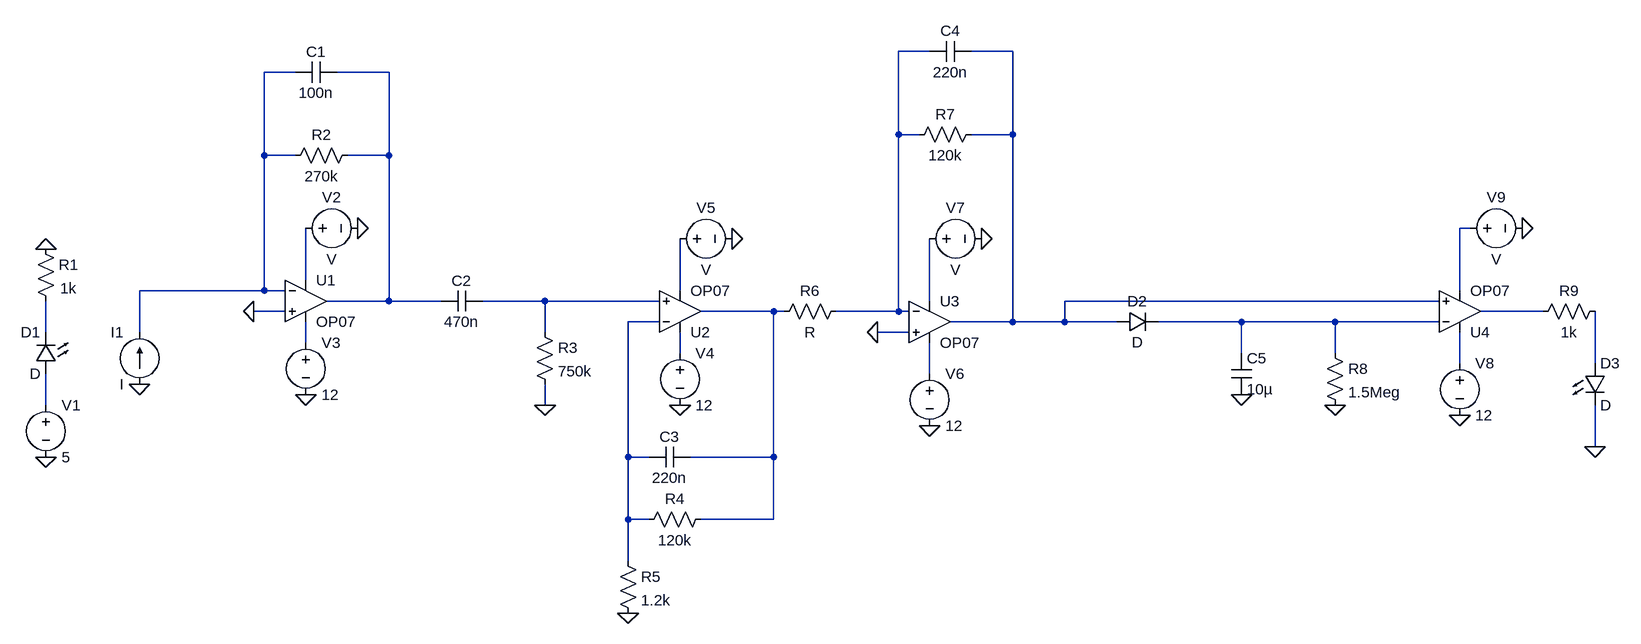
[diagram p0: schematic Pulsefit.asc]
Pulsefit.asc, the LTspice schematic file:
Version 4
SHEET 1 2460 680
WIRE 1376 -432 1328 -432
WIRE 1504 -432 1440 -432
WIRE 400 -400 352 -400
WIRE 544 -400 464 -400
WIRE 1328 -304 1328 -432
WIRE 1360 -304 1328 -304
WIRE 1504 -304 1504 -432
WIRE 1504 -304 1440 -304
WIRE 352 -272 352 -400
WIRE 400 -272 352 -272
WIRE 544 -272 544 -400
WIRE 544 -272 480 -272
WIRE 2208 -160 2192 -160
WIRE 416 -80 416 -160
WIRE 352 -64 352 -272
WIRE 352 -64 160 -64
WIRE 384 -64 352 -64
WIRE 992 -64 992 -144
WIRE 2192 -64 2192 -160
WIRE 544 -48 544 -272
WIRE 544 -48 448 -48
WIRE 624 -48 544 -48
WIRE 784 -48 688 -48
WIRE 960 -48 784 -48
WIRE 1376 -48 1376 -144
WIRE 2160 -48 1584 -48
WIRE 384 -32 336 -32
WIRE 1136 -32 1024 -32
WIRE 1152 -32 1136 -32
WIRE 1328 -32 1328 -304
WIRE 1328 -32 1232 -32
WIRE 1344 -32 1328 -32
WIRE 2320 -32 2224 -32
WIRE 960 -16 912 -16
WIRE 1504 -16 1504 -304
WIRE 1504 -16 1408 -16
WIRE 1584 -16 1584 -48
WIRE 1584 -16 1504 -16
WIRE 1664 -16 1584 -16
WIRE 1856 -16 1728 -16
WIRE 2000 -16 1856 -16
WIRE 2160 -16 2000 -16
WIRE 16 0 16 -48
WIRE 160 0 160 -64
WIRE 784 0 784 -48
WIRE 1344 0 1296 0
WIRE 416 16 416 -16
WIRE 992 32 992 0
WIRE 1856 32 1856 -16
WIRE 2000 32 2000 -16
WIRE 2192 48 2192 0
WIRE 2400 48 2400 -32
WIRE 1376 64 1376 16
WIRE 16 112 16 64
WIRE 784 112 784 80
WIRE 2400 176 2400 112
WIRE 912 192 912 -16
WIRE 944 192 912 192
WIRE 1136 192 1136 -32
WIRE 1136 192 1008 192
WIRE 912 288 912 192
WIRE 944 288 912 288
WIRE 1136 288 1136 192
WIRE 1136 288 1024 288
WIRE 912 352 912 288
FLAG 16 192 0
FLAG 16 -128 0
FLAG 160 80 0
FLAG 336 -32 0
FLAG 496 -160 0
FLAG 416 96 0
FLAG 784 112 0
FLAG 912 432 0
FLAG 992 112 0
FLAG 1072 -144 0
FLAG 1296 0 0
FLAG 1456 -144 0
FLAG 1376 144 0
FLAG 1856 96 0
FLAG 2000 112 0
FLAG 2288 -160 0
FLAG 2192 128 0
FLAG 2400 176 0
SYMBOL voltage 16 96 R0
WINDOW 123 0 0 Left 0
WINDOW 39 0 0 Left 0
SYMATTR InstName V1
SYMATTR Value 5
SYMBOL LED 32 64 R180
WINDOW 0 24 64 Left 2
WINDOW 3 24 0 Left 2
SYMATTR InstName D1
SYMBOL res 0 -144 R0
WINDOW 3 38 76 Left 2
SYMATTR InstName R1
SYMATTR Value 1k
SYMBOL current 160 80 R180
WINDOW 0 24 80 Left 2
WINDOW 3 24 0 Left 2
SYMATTR InstName I1
SYMBOL Opamps\\OP07 416 -112 R0
SYMATTR InstName U1
SYMBOL res 496 -288 R90
WINDOW 0 0 56 VBottom 2
WINDOW 3 32 56 VTop 2
SYMATTR InstName R2
SYMATTR Value 270k
SYMBOL cap 464 -416 R90
WINDOW 0 0 32 VBottom 2
WINDOW 3 32 32 VTop 2
SYMATTR InstName C1
SYMATTR Value 100n
SYMBOL voltage 400 -160 R270
WINDOW 0 32 56 VTop 2
WINDOW 3 -32 56 VBottom 2
SYMATTR InstName V2
SYMBOL voltage 416 0 R0
WINDOW 123 0 0 Left 0
WINDOW 39 0 0 Left 0
SYMATTR InstName V3
SYMATTR Value 12
SYMBOL cap 688 -64 R90
WINDOW 0 0 32 VBottom 2
WINDOW 3 32 32 VTop 2
SYMATTR InstName C2
SYMATTR Value 470n
SYMBOL res 768 -16 R0
SYMATTR InstName R3
SYMATTR Value 750k
SYMBOL Opamps\\OP07 992 32 M180
SYMATTR InstName U2
SYMBOL cap 1008 176 R90
WINDOW 0 0 32 VBottom 2
WINDOW 3 32 32 VTop 2
SYMATTR InstName C3
SYMATTR Value 220n
SYMBOL res 1040 272 R90
WINDOW 0 0 56 VBottom 2
WINDOW 3 32 56 VTop 2
SYMATTR InstName R4
SYMATTR Value 120k
SYMBOL res 896 336 R0
SYMATTR InstName R5
SYMATTR Value 1.2k
SYMBOL voltage 992 16 R0
WINDOW 123 0 0 Left 0
WINDOW 39 0 0 Left 0
SYMATTR InstName V4
SYMATTR Value 12
SYMBOL voltage 976 -144 R270
WINDOW 0 32 56 VTop 2
WINDOW 3 -32 56 VBottom 2
SYMATTR InstName V5
SYMBOL Opamps\\OP07 1376 -80 R0
SYMATTR InstName U3
SYMBOL res 1248 -48 R90
WINDOW 0 0 56 VBottom 2
WINDOW 3 32 56 VTop 2
SYMATTR InstName R6
SYMBOL voltage 1376 48 R0
WINDOW 123 0 0 Left 0
WINDOW 39 0 0 Left 0
SYMATTR InstName V6
SYMATTR Value 12
SYMBOL voltage 1360 -144 R270
WINDOW 0 32 56 VTop 2
WINDOW 3 -32 56 VBottom 2
SYMATTR InstName V7
SYMBOL res 1456 -320 R90
WINDOW 0 0 56 VBottom 2
WINDOW 3 32 56 VTop 2
SYMATTR InstName R7
SYMATTR Value 120k
SYMBOL cap 1440 -448 R90
WINDOW 0 0 32 VBottom 2
WINDOW 3 32 32 VTop 2
SYMATTR InstName C4
SYMATTR Value 220n
SYMBOL diode 1664 0 R270
WINDOW 0 32 32 VTop 2
WINDOW 3 0 32 VBottom 2
SYMATTR InstName D2
SYMBOL cap 1840 32 R0
SYMATTR InstName C5
SYMATTR Value 10µ
SYMBOL res 1984 16 R0
SYMATTR InstName R8
SYMATTR Value 1.5Meg
SYMBOL Opamps\\OP07 2192 32 M180
SYMATTR InstName U4
SYMBOL voltage 2192 32 R0
WINDOW 123 0 0 Left 0
WINDOW 39 0 0 Left 0
SYMATTR InstName V8
SYMATTR Value 12
SYMBOL voltage 2192 -160 R270
WINDOW 0 32 56 VTop 2
WINDOW 3 -32 56 VBottom 2
SYMATTR InstName V9
SYMBOL res 2416 -48 R90
WINDOW 0 0 56 VBottom 2
WINDOW 3 32 56 VTop 2
SYMATTR InstName R9
SYMATTR Value 1k
SYMBOL LED 2384 48 R0
SYMATTR InstName D3

The netlist it stands for:
* Pulsefit.asc
V1 N020 0 5
D1 N020 N014 D
R1 0 N014 1k
I1 0 N003 I
XU1 0 N003 N006 N015 N004 LT1001  ; OP07, pins In+ In- V+ V- OUT
R2 N004 N003 270k
C1 N004 N003 100n
V2 N006 0 V
V3 N015 0 12
C2 N008 N004 470n
R3 N008 0 750k
XU2 N008 N012 N016 N007 N010 LT1001  ; OP07, pins In+ In- V+ V- OUT
C3 N010 N012 220n
R4 N010 N012 120k
R5 N012 0 1.2k
V4 N016 0 12
V5 N007 0 V
XU3 0 N001 N009 N019 N002 LT1001  ; OP07, pins In+ In- V+ V- OUT
R6 N001 N010 R
V6 N019 0 12
V7 N009 0 V
R7 N002 N001 120k
C4 N002 N001 220n
D2 N002 N013 D
C5 N013 0 10µ
R8 N013 0 1.5Meg
XU4 N002 N013 N017 N005 N011 LT1001  ; OP07, pins In+ In- V+ V- OUT
V8 N017 0 12
V9 N005 0 V
R9 N018 N011 1k
D3 N018 0 D
.model D D
.lib standard.dio
.lib LTC.lib
.backanno
.end